# EAGLE design OSIVE Slim (EAGLE 9.0.1)

## Sheet 1 of 2
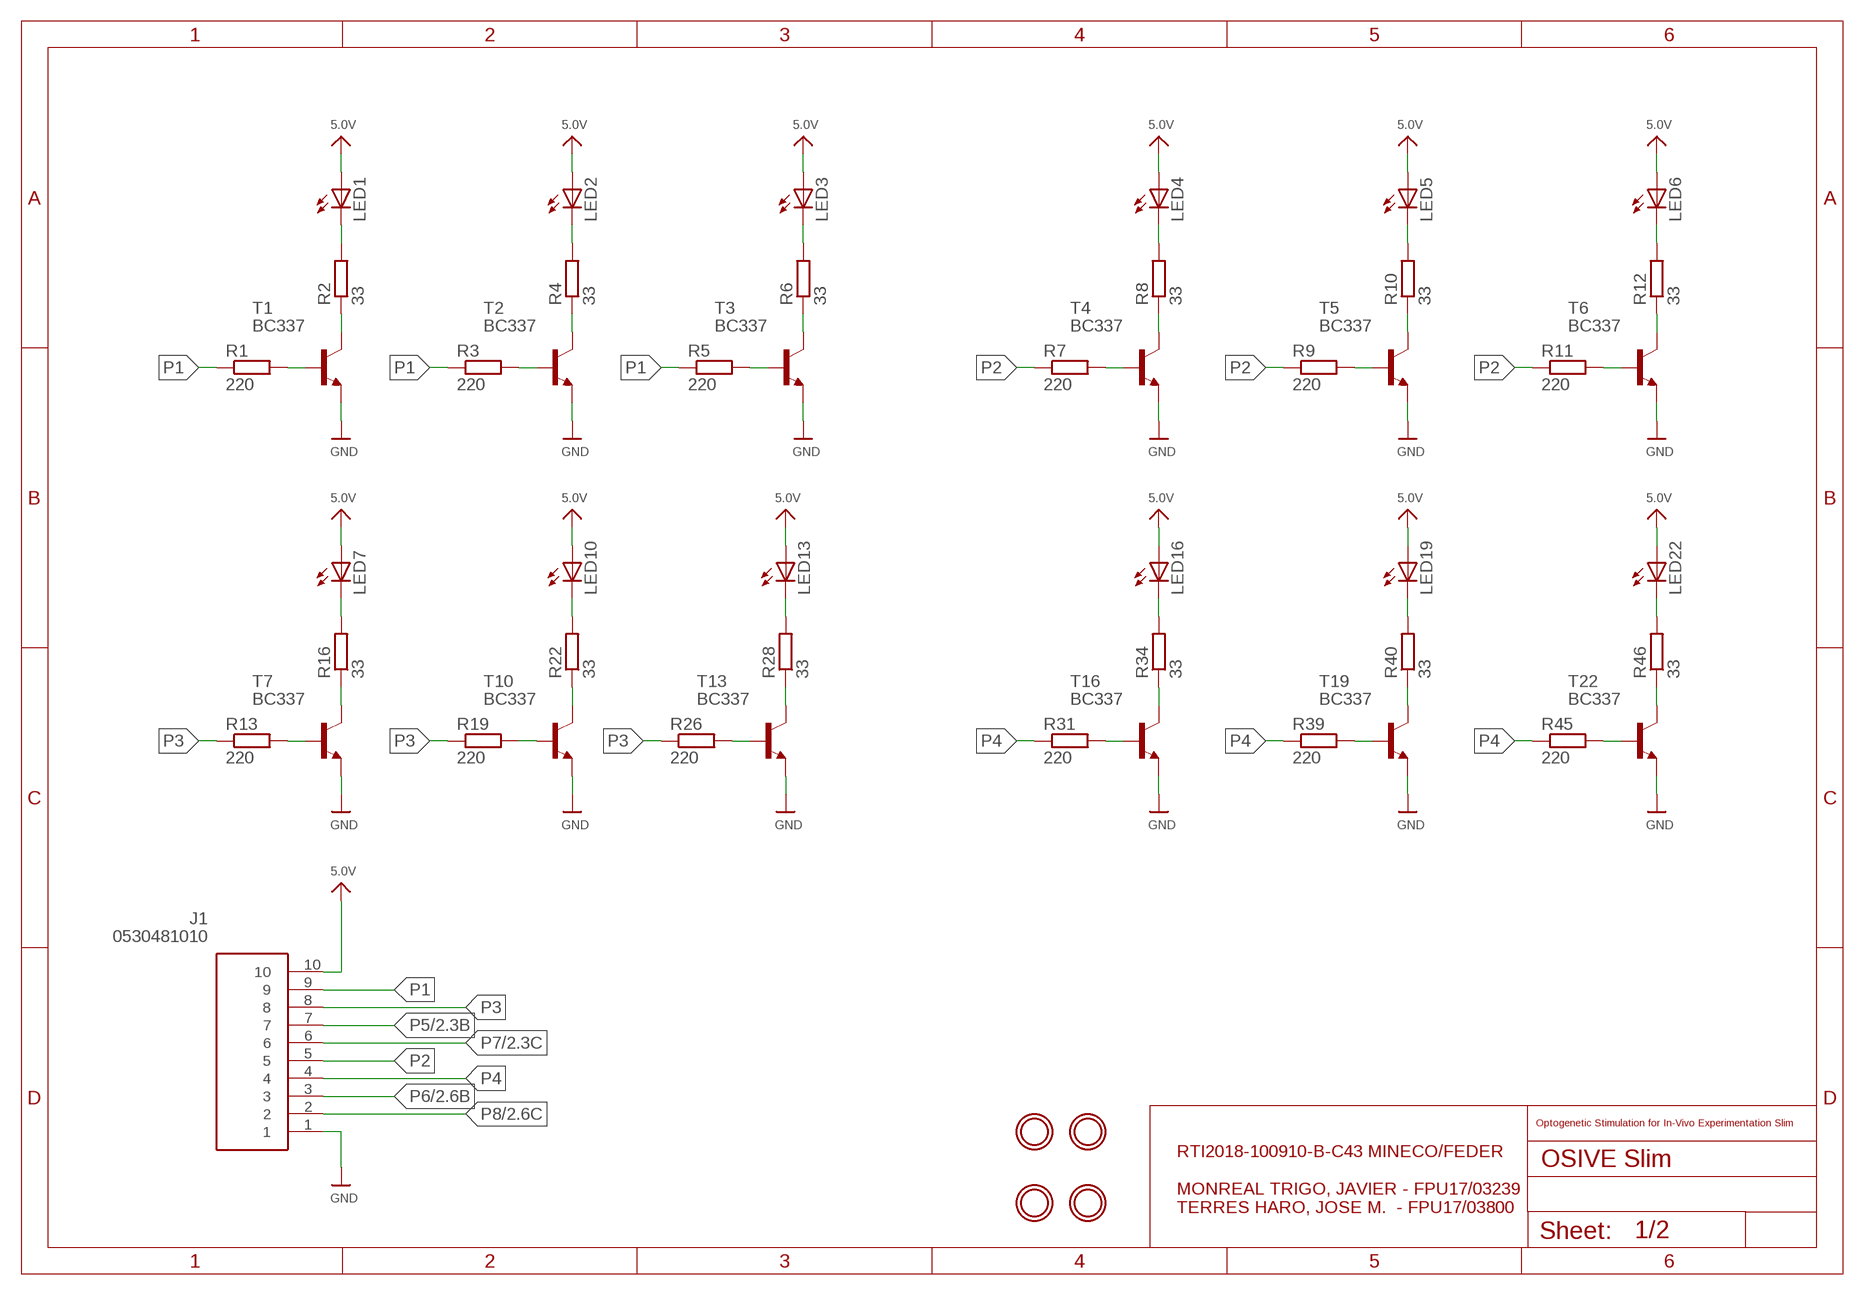
[diagram p0: schematic, sheet 1]

### Parts
H1  MOUNTINGHOLE3.0THIN  [MOUNTINGHOLE_3.0_PLATEDTHIN]
H2  MOUNTINGHOLE3.0THIN  [MOUNTINGHOLE_3.0_PLATEDTHIN]
H3  MOUNTINGHOLE3.0THIN  [MOUNTINGHOLE_3.0_PLATEDTHIN]
H4  MOUNTINGHOLE3.0THIN  [MOUNTINGHOLE_3.0_PLATEDTHIN]
J1  0530481010  [0530481010]
LED1  LED5MM  [LED5MM]
LED2  LED5MM  [LED5MM]
LED3  LED5MM  [LED5MM]
LED4  LED5MM  [LED5MM]
LED5  LED5MM  [LED5MM]
LED6  LED5MM  [LED5MM]
LED7  LED5MM  [LED5MM]
LED10  LED5MM  [LED5MM]
LED13  LED5MM  [LED5MM]
LED16  LED5MM  [LED5MM]
LED19  LED5MM  [LED5MM]
LED22  LED5MM  [LED5MM]
R1  220  R-EU_0204/7  [0204/7]
R2  33  R-EU_0204/7  [0204/7]
R3  220  R-EU_0204/7  [0204/7]
R4  33  R-EU_0204/7  [0204/7]
R5  220  R-EU_0204/7  [0204/7]
R6  33  R-EU_0204/7  [0204/7]
R7  220  R-EU_0204/7  [0204/7]
R8  33  R-EU_0204/7  [0204/7]
R9  220  R-EU_0204/7  [0204/7]
R10  33  R-EU_0204/7  [0204/7]
R11  220  R-EU_0204/7  [0204/7]
R12  33  R-EU_0204/7  [0204/7]
R13  220  R-EU_0204/7  [0204/7]
R16  33  R-EU_0204/7  [0204/7]
R19  220  R-EU_0204/7  [0204/7]
R22  33  R-EU_0204/7  [0204/7]
R26  220  R-EU_0204/7  [0204/7]
R28  33  R-EU_0204/7  [0204/7]
R31  220  R-EU_0204/7  [0204/7]
R34  33  R-EU_0204/7  [0204/7]
R39  220  R-EU_0204/7  [0204/7]
R40  33  R-EU_0204/7  [0204/7]
R45  220  R-EU_0204/7  [0204/7]
R46  33  R-EU_0204/7  [0204/7]
T1  BC337  [TO92]
T2  BC337  [TO92]
T3  BC337  [TO92]
T4  BC337  [TO92]
T5  BC337  [TO92]
T6  BC337  [TO92]
T7  BC337  [TO92]
T10  BC337  [TO92]
T13  BC337  [TO92]
T16  BC337  [TO92]
T19  BC337  [TO92]
T22  BC337  [TO92]

### Nets
5.0V: J1.10 LED1.A LED2.A LED3.A LED4.A LED5.A LED6.A LED7.A LED10.A LED13.A LED16.A LED19.A LED22.A ; also sheet 2
GND: J1.1 T1.1(E) T2.1(E) T3.1(E) T4.1(E) T5.1(E) T6.1(E) T7.1(E) T10.1(E) T13.1(E) T16.1(E) T19.1(E) T22.1(E) ; also sheet 2
N$1: R1.2 T1.2(B)
N$2: R3.2 T2.2(B)
N$3: R4.1 T2.3(C)
N$4: R5.2 T3.2(B)
N$5: R2.1 T1.3(C)
N$6: R6.1 T3.3(C)
N$7: R8.1 T4.3(C)
N$8: R10.1 T5.3(C)
N$9: R7.2 T4.2(B)
N$10: LED1.K(C) R2.2
N$11: R9.2 T5.2(B)
N$12: R12.1 T6.3(C)
N$13: R46.1 T22.3(C)
N$14: R40.1 T19.3(C)
N$15: R34.1 T16.3(C)
N$16: R28.1 T13.3(C)
N$17: R11.2 T6.2(B)
N$18: LED2.K(C) R4.2
N$19: R13.2 T7.2(B)
N$20: R22.1 T10.3(C)
N$21: R16.1 T7.3(C)
N$25: R19.2 T10.2(B)
N$26: LED3.K(C) R6.2
N$36: R26.2 T13.2(B)
N$37: R31.2 T16.2(B)
N$38: R39.2 T19.2(B)
N$39: R45.2 T22.2(B)
N$42: LED4.K(C) R8.2
N$46: LED5.K(C) R10.2
N$50: LED6.K(C) R12.2
N$66: LED7.K(C) R16.2
N$70: LED10.K(C) R22.2
N$74: LED13.K(C) R28.2
N$90: LED16.K(C) R34.2
N$94: LED19.K(C) R40.2
N$98: LED22.K(C) R46.2
P1: J1.9 R1.1 R3.1 R5.1
P2: J1.5 R7.1 R9.1 R11.1
P3: J1.8 R13.1 R19.1 R26.1
P4: J1.4 R31.1 R39.1 R45.1
P5: J1.7 ; also sheet 2
P6: J1.3 ; also sheet 2
P7: J1.6 ; also sheet 2
P8: J1.2 ; also sheet 2

### Notes on the sheet
- Optogenetic Stimulation for In-Vivo Experimentation Slim
- RTI2018-100910-B-C43 MINECO/FEDER
  
  MONREAL TRIGO, JAVIER - FPU17/03239
  TERRES HARO, JOSE M.  - FPU17/03800

## Sheet 2 of 2
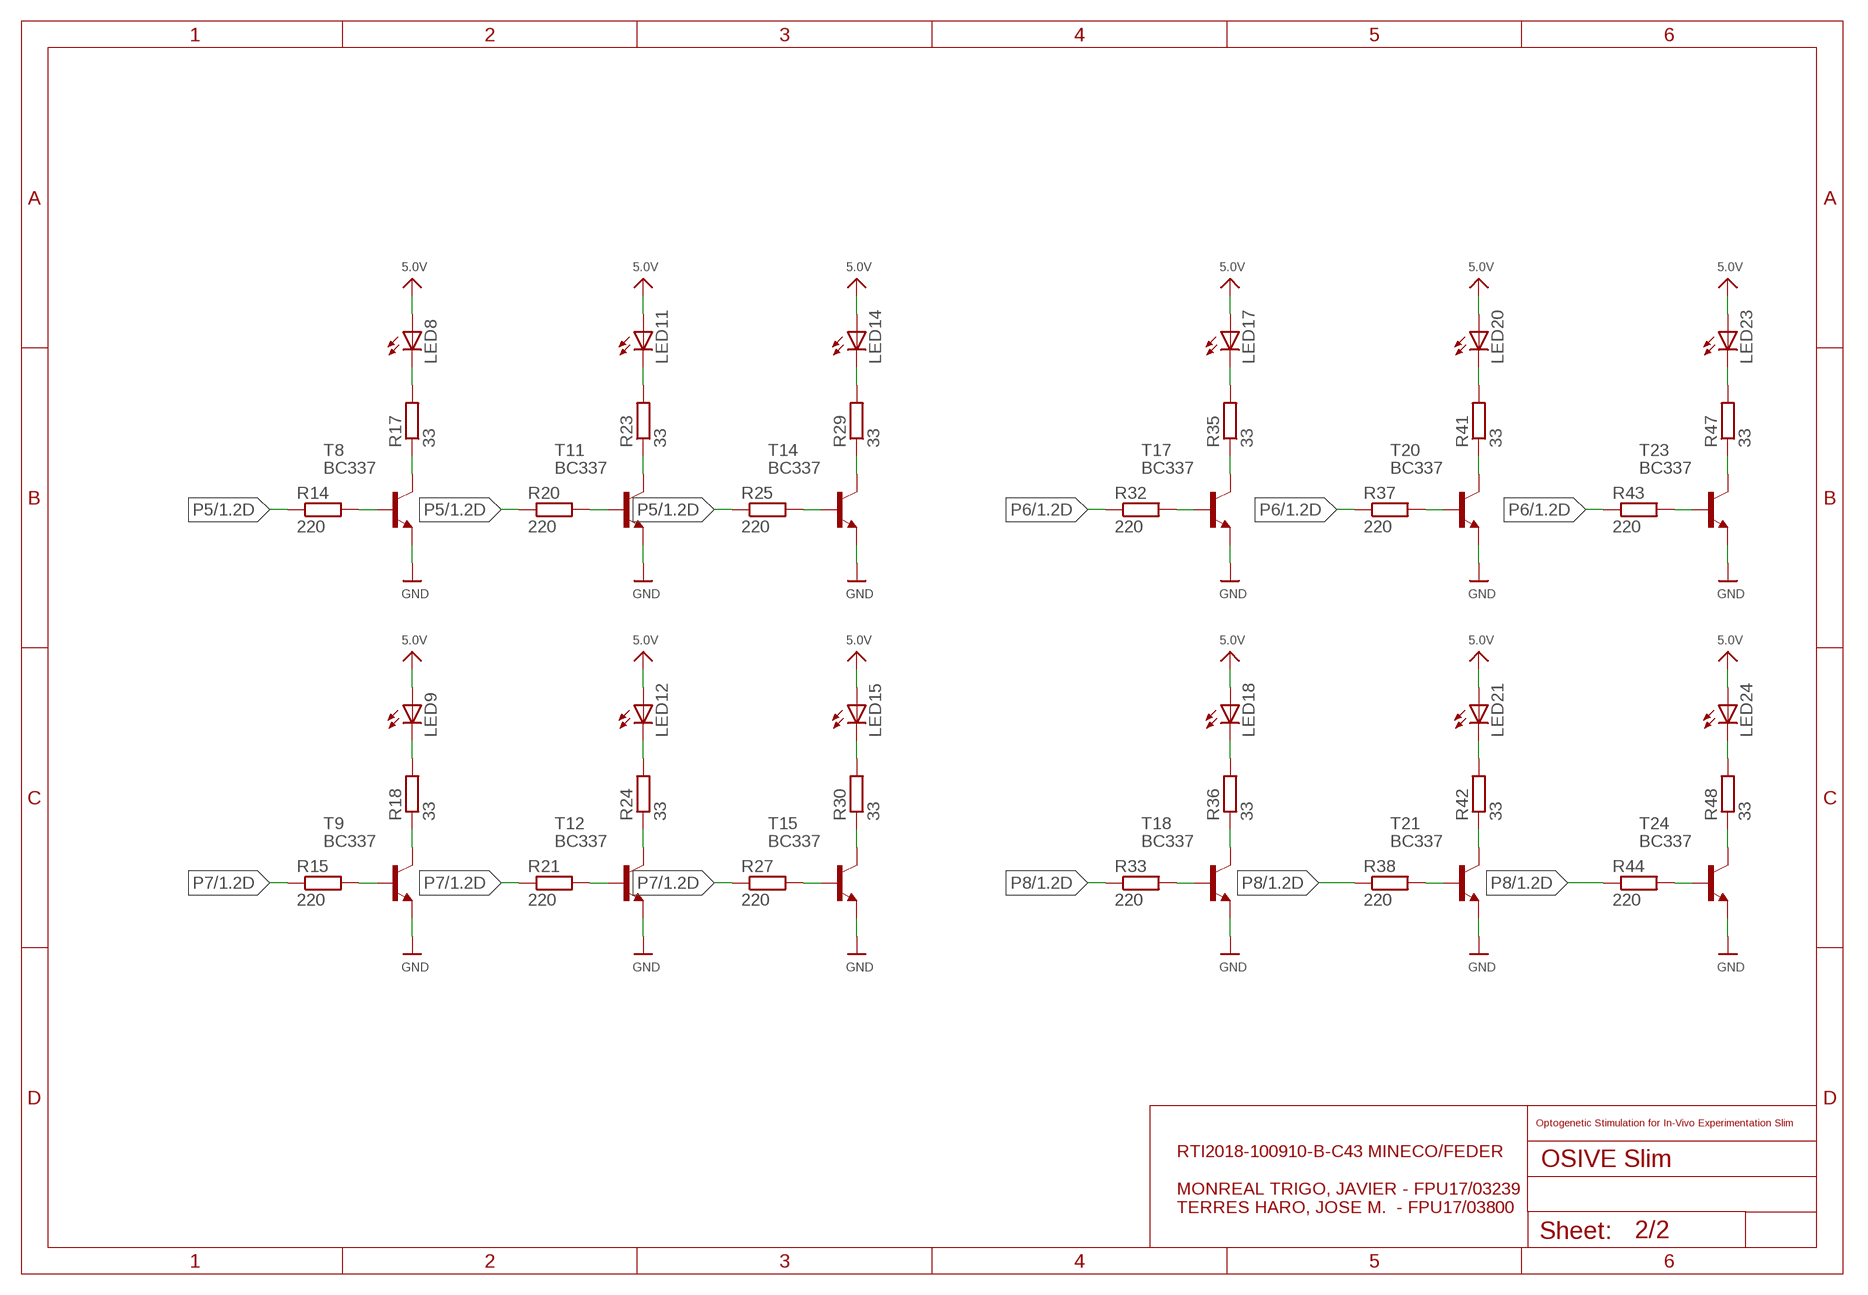
[diagram p1: schematic, sheet 2]

### Parts
LED8  LED5MM  [LED5MM]
LED9  LED5MM  [LED5MM]
LED11  LED5MM  [LED5MM]
LED12  LED5MM  [LED5MM]
LED14  LED5MM  [LED5MM]
LED15  LED5MM  [LED5MM]
LED17  LED5MM  [LED5MM]
LED18  LED5MM  [LED5MM]
LED20  LED5MM  [LED5MM]
LED21  LED5MM  [LED5MM]
LED23  LED5MM  [LED5MM]
LED24  LED5MM  [LED5MM]
R14  220  R-EU_0204/7  [0204/7]
R15  220  R-EU_0204/7  [0204/7]
R17  33  R-EU_0204/7  [0204/7]
R18  33  R-EU_0204/7  [0204/7]
R20  220  R-EU_0204/7  [0204/7]
R21  220  R-EU_0204/7  [0204/7]
R23  33  R-EU_0204/7  [0204/7]
R24  33  R-EU_0204/7  [0204/7]
R25  220  R-EU_0204/7  [0204/7]
R27  220  R-EU_0204/7  [0204/7]
R29  33  R-EU_0204/7  [0204/7]
R30  33  R-EU_0204/7  [0204/7]
R32  220  R-EU_0204/7  [0204/7]
R33  220  R-EU_0204/7  [0204/7]
R35  33  R-EU_0204/7  [0204/7]
R36  33  R-EU_0204/7  [0204/7]
R37  220  R-EU_0204/7  [0204/7]
R38  220  R-EU_0204/7  [0204/7]
R41  33  R-EU_0204/7  [0204/7]
R42  33  R-EU_0204/7  [0204/7]
R43  220  R-EU_0204/7  [0204/7]
R44  220  R-EU_0204/7  [0204/7]
R47  33  R-EU_0204/7  [0204/7]
R48  33  R-EU_0204/7  [0204/7]
T8  BC337  [TO92]
T9  BC337  [TO92]
T11  BC337  [TO92]
T12  BC337  [TO92]
T14  BC337  [TO92]
T15  BC337  [TO92]
T17  BC337  [TO92]
T18  BC337  [TO92]
T20  BC337  [TO92]
T21  BC337  [TO92]
T23  BC337  [TO92]
T24  BC337  [TO92]

### Nets
5.0V: LED8.A LED9.A LED11.A LED12.A LED14.A LED15.A LED17.A LED18.A LED20.A LED21.A LED23.A LED24.A ; also sheet 1
GND: T8.1(E) T9.1(E) T11.1(E) T12.1(E) T14.1(E) T15.1(E) T17.1(E) T18.1(E) T20.1(E) T21.1(E) T23.1(E) T24.1(E) ; also sheet 1
N$22: R35.1 T17.3(C)
N$23: R29.1 T14.3(C)
N$24: R17.1 T8.3(C)
N$27: R47.1 T23.3(C)
N$28: R41.1 T20.3(C)
N$29: R18.1 T9.3(C)
N$30: R24.1 T12.3(C)
N$31: R30.1 T15.3(C)
N$32: R48.1 T24.3(C)
N$33: R42.1 T21.3(C)
N$34: R36.1 T18.3(C)
N$35: R23.1 T11.3(C)
N$40: R43.2 T23.2(B)
N$41: R37.2 T20.2(B)
N$43: R32.2 T17.2(B)
N$44: R25.2 T14.2(B)
N$45: R20.2 T11.2(B)
N$47: R14.2 T8.2(B)
N$48: R15.2 T9.2(B)
N$49: R21.2 T12.2(B)
N$51: R27.2 T15.2(B)
N$52: R33.2 T18.2(B)
N$53: R38.2 T21.2(B)
N$54: R44.2 T24.2(B)
N$114: LED8.K(C) R17.2
N$118: LED11.K(C) R23.2
N$122: LED14.K(C) R29.2
N$138: LED17.K(C) R35.2
N$142: LED20.K(C) R41.2
N$146: LED23.K(C) R47.2
N$162: LED9.K(C) R18.2
N$166: LED12.K(C) R24.2
N$170: LED15.K(C) R30.2
N$186: LED18.K(C) R36.2
N$190: LED21.K(C) R42.2
N$194: LED24.K(C) R48.2
P5: R14.1 R20.1 R25.1 ; also sheet 1
P6: R32.1 R37.1 R43.1 ; also sheet 1
P7: R15.1 R21.1 R27.1 ; also sheet 1
P8: R33.1 R38.1 R44.1 ; also sheet 1

### Notes on the sheet
- Optogenetic Stimulation for In-Vivo Experimentation Slim
- RTI2018-100910-B-C43 MINECO/FEDER
  
  MONREAL TRIGO, JAVIER - FPU17/03239
  TERRES HARO, JOSE M.  - FPU17/03800

## Library data of the parts
H1-H4 = microbuilder:MOUNTINGHOLE: Mounting Hole For #2 screws (0.086"/2.18mm width, 0.094"/2.4mm hole) use 2.5mm
J1 = 0530481010:0530481010: Conn Shrouded Header (4 Sides) HDR 10 POS 1.25mm Solder RA Thru-Hole PicoBlade Tray Source: Datasheet <https://datasheet.datasheetarchive.com/originals/distributors/Datasheets-DGA22/2091711.pdf>; ARROW_PART_NUMBER: 0530481010; ARROW_PRICE-STOCK: https://www.arrow.com/en/products/0530481010/molex; DESCRIPTION: Conn Shrouded Header (4 Sides) HDR 10 POS 1.25mm Solder RA Thru-Hole PicoBlade Tray; HEIGHT: 3.7mm; MANUFACTURER_NAME: Molex; MANUFACTURER_PART_NUMBER: 0530481010
LED1-LED24 = led:LED: LED OSRAM: - CHIPLED LG R971, LG N971, LY N971, LG Q971, LY Q971, LO R971, LY R971 LH N974, LH R974 LS Q976, LO Q976, LY Q976 LO Q996 - Hyper CHIPLED LW Q18S LB Q993, LB Q99A, LB R99A - SideLED LS A670, LO A670, LY A670, LG A670, LP A670 LB A673, LV A673, LT A673, LW A673 LH A674 LY A675 LS A676, LA A676, LO A676, LY A676, LW A676 LS A679, LY A679, LG A679 - Hyper Micro SIDELED® LS Y876, LA Y876, LO Y876, LY Y876 LT Y87S - SmartLED LW L88C, LW L88S LB L89C, LB L89S, LG L890 LS L89K, LO L89K, LY L89K LS L896, LA L896, LO L896, LY L896 - TOPLED LS T670, LO T670, LY T670, LG T670, LP T670 LSG T670, LSP T670, LSY T670, LOP T670, LYG T670 LG T671, LOG T671, LSG T671 LB T673, LV T673, LT T673, LW T673 LH T674 LS T676, LA T676, LO T676, LY T676, LB T676, LH T676, LSB T676, LW T676 LB T67C, LV T67C, LT T67C, LS T67K, LO T67K, LY T67K, LW E67C LS E67B, LA E67B, LO E67B, LY E67B, LB E67C, LV E67C, LT E67C LW T67C LS T679, LY T679, LG T679 LS T770, LO T770, LY T770, LG T770, LP T770 LB T773, LV T773, LT T773, LW T773 LH T774 LS E675, LA E675, LY E675, LS T675 LS T776, LA T776, LO T776, LY T776, LB T776 LHGB T686 LT T68C, LB T68C - Hyper Mini TOPLED® LB M676 - Mini TOPLED Santana® LG M470 LS M47K, LO M47K, LY M47K Source: http://www.osram.convergy.de LUXEON: - LUMILED® LXK2-PW12-R00, LXK2-PW12-S00, LXK2-PW14-U00, LXK2-PW14-V00 LXK2-PM12-R00, LXK2-PM12-S00, LXK2-PM14-U00 LXK2-PE12-Q00, LXK2-PE12-R00, LXK2-PE12-S00, LXK2-PE14-T00, LXK2-PE14-U00 LXK2-PB12-K00, LXK2-PB12-L00, LXK2-PB12-M00, LXK2-PB14-N00, LXK2-PB14-P00, LXK2-PB14-Q00 LXK2-PR12-L00, LXK2-PR12-M00, LXK2-PR14-Q00, LXK2-PR14-R00 LXK2-PD12-Q00, LXK2-PD12-R00, LXK2-PD12-S00 LXK2-PH12-R00, LXK2-PH12-S00 LXK2-PL12-P00, LXK2-PL12-Q00, LXK2-PL12-R00 Source: www.luxeon.com KINGBRIGHT: KA-3528ASYC Source: www.kingbright.com
R1-R48 = resistor:R-EU_: RESISTOR, European symbol
T1-T24 = transistor:BC337: NPN TRANSISTOR

## Board
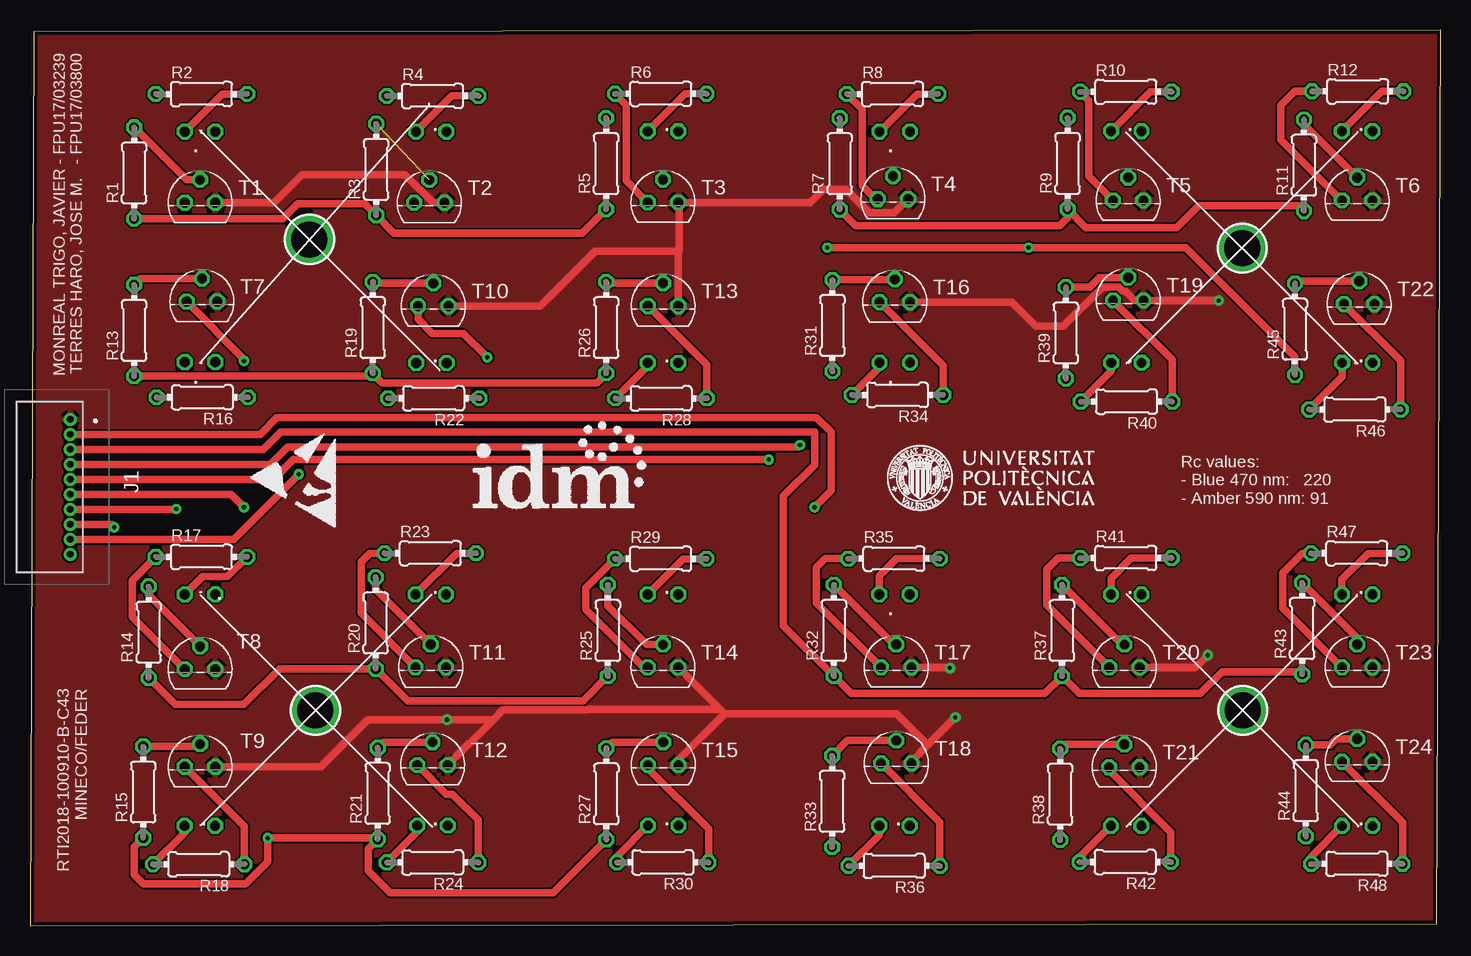
[diagram p2: board, top side]
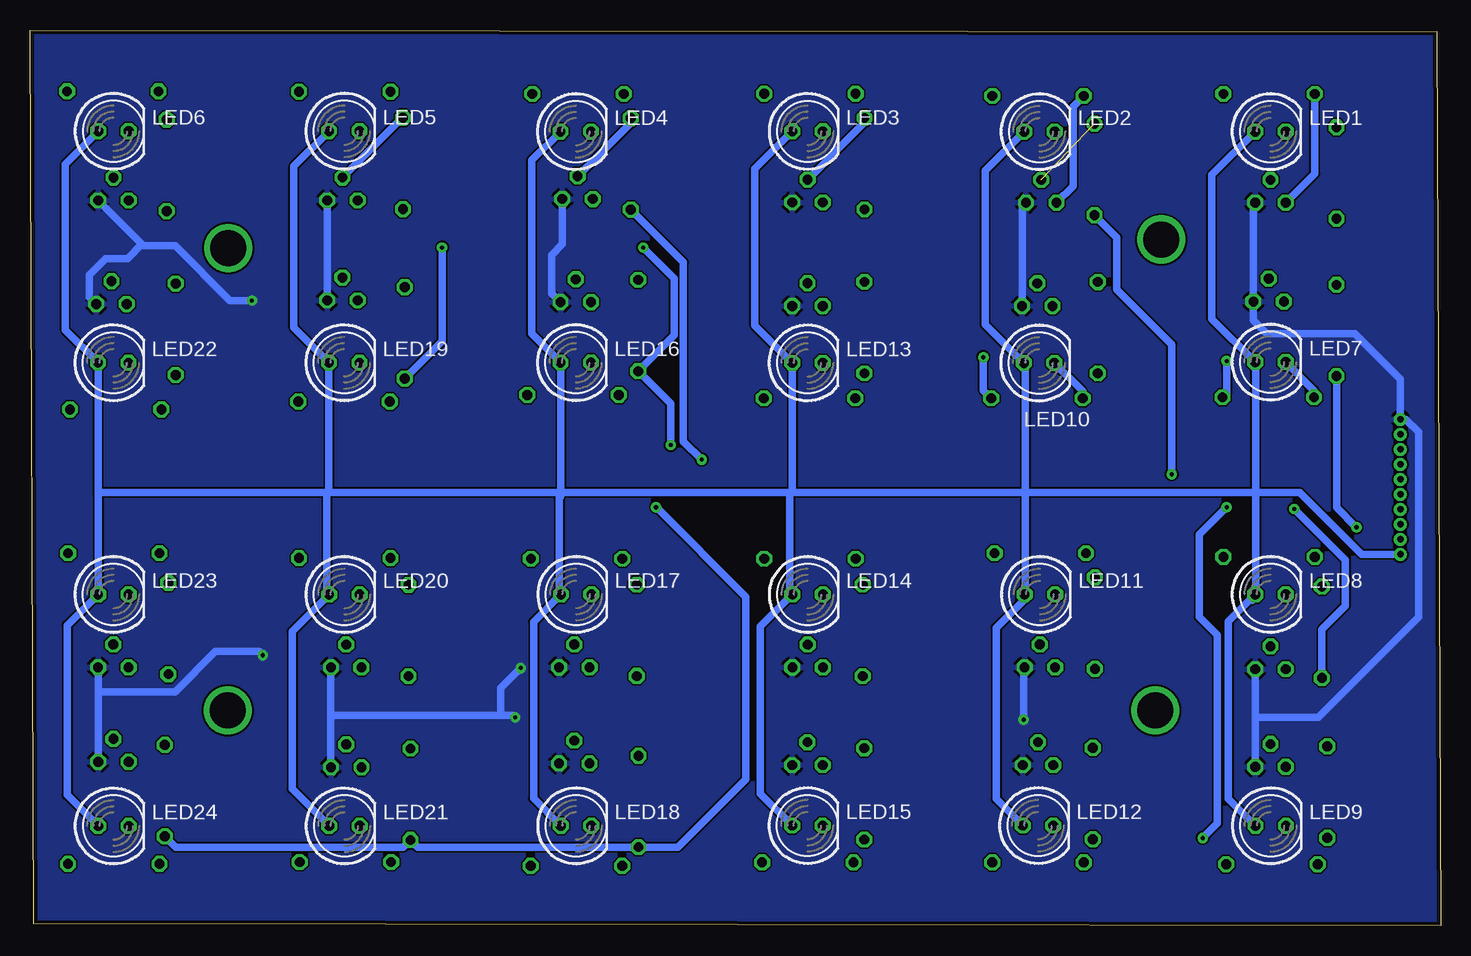
[diagram p3: board, bottom side, seen from below]

Size 117.55 x 74.69 mm. Coordinates in mm from the lower left corner, seen from the top.
Outline: 0,0 117.24,0.15 117.55,74.69 0.3,74.53 0,0
Copper layers (1*16): Top 0.035mm / dielectric 1.5mm / Bottom 0.035mm
Design rules "default *": minimum track width 6mil, minimum drill 0.3mm, track to track 6mil, track to pad 6mil, pad to pad 6mil, via to via 6mil, smd to smd 6mil, copper to edge 12mil, drill to drill 12mil, minimum pad ring 10mil, minimum via ring 10mil, stop-mask expansion 4mil, vias tented up to drill 0mil, thermal gap 10mil

### Footprints (pad centres in the part's own frame; a part is rotated, then mirrored left to right if it is on the bottom)
MOUNTINGHOLE_3.0_PLATEDTHIN = drill 3 pad 3.6: P$1 0,0
0530481010 = drill 0.55 pad 1.1: 1 0,0; 2 -1.25,0; 3 -2.5,0; 4 -3.75,0; 5 -5,0; 6 -6.25,0; 7 -7.5,0; 8 -8.75,0; 9 -10,0; 10 -11.25,0
LED5MM = drill 0.813 octagon: A -1.27,0; K 1.27,0
0204/7 = drill 0.813 octagon: 1 -3.81,0; 2 3.81,0
TO92 = drill 0.813 octagon: 1 1.27,0; 2 0,1.905; 3 -1.27,0

### Placement (x,y rotation side)
H1  23.79,17.97 0 top
H2  101.06,17.95 0 top
H3  23.28,57.22 0 top
H4  101.02,56.51 0 top
J1  3.35,42.21 90 top
LED1  14.18,66.21 0 bottom
LED2  33.43,66.21 0 bottom
LED3  52.75,66.23 0 bottom
LED4  72.07,66.22 0 bottom
LED5  91.36,66.25 0 bottom
LED6  110.6,66.25 0 bottom
LED7  14.18,47 0 bottom
LED8  14.18,27.62 0 bottom
LED9  14.15,8.34 0 bottom
LED10  33.46,46.92 0 bottom
LED11  33.39,27.62 0 bottom
LED12  33.55,8.35 0 bottom
LED13  52.76,46.93 0 bottom
LED14  52.74,27.62 0 bottom
LED15  52.77,8.35 0 bottom
LED16  72.07,46.95 0 bottom
LED17  72.03,27.63 0 bottom
LED18  72.04,8.34 0 bottom
LED19  91.36,46.94 0 bottom
LED20  91.35,27.62 0 bottom
LED21  91.35,8.32 0 bottom
LED22  110.61,46.94 0 bottom
LED23  110.6,27.62 0 bottom
LED24  110.6,8.32 0 bottom
R1  8.67,62.76 90 top
R2  14.29,69.35 0 top
R3  28.84,63.06 90 top
R4  33.55,69.19 0 top
R5  48.01,63.54 90 top
R6  52.56,69.37 0 top
R7  67.48,63.52 90 top
R8  71.88,69.35 0 top
R9  86.47,63.56 90 top
R10  91.32,69.54 0 top
R11  106.16,63.4 90 top
R12  110.65,69.57 0 top
R13  8.67,49.63 90 top
R14  9.89,24.47 90 top
R15  9.44,11.14 90 top
R16  14.36,44.06 180 top
R17  14.29,30.75 0 top
R18  14.06,5.13 180 top
R19  28.56,49.87 90 top
R20  28.81,25.23 90 top
R21  28.98,11.02 90 top
R22  33.64,43.98 180 top
R23  33.36,31.06 0 top
R24  33.55,5.28 180 top
R25  48.16,24.62 90 top
R26  48.02,49.87 90 top
R27  48.03,10.99 90 top
R28  52.59,43.97 180 top
R29  52.55,30.6 0 top
R30  52.73,5.28 180 top
R31  66.87,50.05 90 top
R32  66.99,24.63 90 top
R33  66.84,10.36 90 top
R34  72.29,44.25 180 top
R35  72,30.61 0 top
R36  72.02,4.99 180 top
R37  86,24.62 90 top
R38  85.84,10.96 90 top
R39  86.32,49.43 90 top
R40  91.37,43.7 180 top
R41  91.32,30.66 0 top
R42  91.27,5.31 180 top
R43  106.02,24.78 90 top
R44  106.32,11.26 90 top
R45  105.41,49.73 90 top
R46  110.41,43.04 180 top
R47  110.57,31.06 0 top
R48  110.57,5.16 180 top
T1  14.18,60.29 0 top
T2  33.28,60.28 0 top
T3  52.75,60.31 0 top
T4  71.91,60.59 0 top
T5  91.51,60.48 0 top
T6  110.6,60.47 0 top
T7  14.33,52.04 0 top
T8  14.18,21.39 0 top
T9  14.18,13.25 0 top
T10  33.61,51.66 0 top
T11  33.39,21.54 0 top
T12  33.55,13.4 0 top
T13  52.76,51.67 0 top
T14  52.74,21.54 0 top
T15  52.77,13.4 0 top
T16  72.07,52 0 top
T17  72.19,21.55 0 top
T18  72.19,13.53 0 top
T19  91.52,52.14 0 top
T20  91.2,21.54 0 top
T21  91.19,13.21 0 top
T22  110.76,51.84 0 top
T23  110.6,21.54 0 top
T24  110.6,13.67 0 top

### Tracks (layer width: path | path; a pad name or v marks a point on that pad's centre or on a via)
5.0V
  Bottom 0.61: J1.10 6.58,30.97 11.73,36.12 15.39,36.12 | 15.39,36.12 34.59,36.12 | 34.59,36.12 54.25,36.12 | 54.25,36.12 73.46,36.12 | 73.46,36.12 92.81,36.12 | 92.81,36.12 111.71,36.12 111.87,35.96 | 111.87,35.96 LED23.A 114.45,25.05 114.45,10.9 LED24.A | 111.87,35.96 LED22.A 114.61,49.67 114.61,63.51 LED6.A | 92.81,36.12 92.81,27.81 LED20.A 95.71,24.53 95.71,11.41 LED21.A | 73.46,36.12 73.46,35.66 | 73.46,35.66 73.46,27.78 LED17.A 75.59,25.34 75.59,10.62 LED18.A | 54.25,36.12 54.25,27.86 LED14.A 56.69,24.94 56.69,11.01 LED15.A | 34.59,36.12 34.59,27.69 LED11.A 34.66,27.21 37.03,24.84 37.03,10.57 LED12.A | 15.39,36.12 15.39,27.43 15.7,27.13 15.7,27.37 LED8.A 17.68,25.39 17.68,10.59 LED9.A | 15.39,36.12 15.39,46.94 LED7.A 19.05,50.6 19.05,62.61 LED1.A | 34.59,36.12 34.59,46.79 LED10.A 37.95,50.14 37.95,62.96 LED2.A | 54.25,36.12 54.03,36.35 LED13.A 57.15,50.05 57.15,63.1 LED3.A | 73.46,35.66 73.34,35.78 LED16.A 75.74,49.36 75.74,63.81 LED4.A | 92.81,36.12 92.63,36.3 LED19.A 95.56,49.86 95.56,63.33 LED5.A
GND  (via drill 0.35)
  Top 0.61: v98.15,22.56 97.13,21.54 T20.1 | v77.11,17.37 74.83,15.09 | 74.83,15.09 73.46,13.72 T18.1 | v76.66,21.49 76.6,21.55 T17.1 | 74.83,15.09 72.24,17.68 57.88,17.68 | 57.88,17.68 57.51,18.04 | 57.51,18.04 T14.1 | 57.88,17.68 54.04,13.84 T15.1 | 57.51,18.04 46.47,18.04 46.41,17.98 39.4,17.98 38.6,17.18 | 38.6,17.18 T12.1 | T9.1 24.22,13.25 28.15,17.18 v34.75,17.18 38.6,17.18 | T1.1 20.36,60.29 22.71,62.64 31.23,62.64 33.59,60.28 T2.1 | T10.1 42.52,51.66 47.09,56.24 54.03,56.24 | 54.03,56.24 54.1,56.24 54.1,56.54 | 54.1,56.54 54.1,60.22 T3.1 65.03,60.31 66.14,61.42 67.97,61.42 69.95,59.44 72.03,59.44 T4.1 | T13.1 54.03,56.24 | 54.03,56.24 54.03,56.47 54.1,56.54 | T16.1 81.81,52 83.82,49.99 86.12,49.99 89.39,53.26 90.72,53.26 91.05,52.93 91.29,52.93 92.08,52.14 T19.1 99.04,52.14 v99.06,52.12
  Bottom 0.61: T24.1 111.87,19.51 | 111.87,19.51 T23.1 | 111.87,19.51 105.46,19.51 102.11,22.86 98.45,22.86 v98.15,22.56 | T20.1 92.47,17.53 | 92.47,17.53 92.47,13.22 T21.1 | 92.47,17.53 78.33,17.53 | 78.33,17.53 77.27,17.53 v77.11,17.37 | 78.33,17.53 78.33,19.81 v76.66,21.49 | T11.1 34.75,21.46 v34.75,17.18 | T9.1 15.45,17.53 | 15.45,17.53 T8.1 | 15.45,17.53 15.29,17.37 10.21,17.37 1.83,25.76 1.83,41.15 2.9,42.22 J1.1 3.35,45.57 7.16,49.38 14.48,49.38 15.6,50.5 T7.1 15.6,60.14 T1.1 | T2.1 34.88,59.95 T10.1 | T4.1 73.19,56.81 74.07,55.93 74.07,52.73 T16.1 | T19.1 T5.1 | v99.06,52.12 100.89,52.12 105.46,56.69 108.09,56.69 108.22,56.83 | T6.1 108.22,56.83 | 108.22,56.83 109.42,55.63 111.25,55.63 112.62,54.25 112.62,52.43 T22.1
  pour Bottom: 0.46,74.68 117.65,74.83 117.35,0 0.15,-0.15
  pour Top: 0.61,74.52 117.65,74.68 117.35,0 0.3,-0.15
N$1
  Top 0.61: R1.2 13.05,62.19 T1.2
N$2  (1 unrouted)
N$3
  Bottom 0.61: T2.3 30.63,61.66 30.63,68.29 R4.1
N$4
  Bottom 0.61: T3.2 48.01,66.95 R5.2
N$5
  Bottom 0.61: T1.3 10.48,62.71 R2.1
N$6
  Top 0.61: R6.1 49.68,68.43 49.68,62.1 T3.3
N$7
  Top 0.61: R8.1 69.34,68.07 69.34,61.72 70.47,60.59 T4.3
N$8
  Top 0.61: R10.1 88.24,68.81 88.24,62.48 T5.3
N$9
  Bottom 0.61: T4.2 67.48,66.93 R7.2
N$10
  Top 0.61: LED1.K 16.04,69.35 R2.2
N$11
  Bottom 0.61: T5.2 86.53,67.37 R9.2
N$12
  Top 0.61: R12.1 105.38,69.57 104.24,68.43 104.24,65.56 T6.3
N$13
  Top 0.61: T22.3 114.22,47.11 R46.1
N$14
  Top 0.61: T19.3 95.19,47.2 R40.1
N$15
  Top 0.61: T16.3 76.1,46.69 R34.1
N$16
  Top 0.61: R28.1 56.4,46.78 51.51,51.67 T13.3
N$17
  Top 0.61: R11.2 106.16,66.81 T6.2
N$18
  Top 0.61: R4.2 35.14,69.19 LED2.K
N$19
  Top 0.61: T7.2 9.18,53.95 R13.2
N$20  (via drill 0.35)
  Top 0.61: v38.1,47.4 36.12,49.38 33.53,49.38 32.34,50.57 T10.3
  Bottom 0.61: R22.1 38.1,44.63 v38.1,47.4
N$21  (via drill 0.35)
  Top 0.61: T7.3 17.83,47.27 v17.83,47.09
  Bottom 0.61: v17.83,47.09 17.83,46.33 17.83,44.4 R16.1
N$22
  Top 0.61: R35.1 66.27,30.61 65.53,29.87 65.53,26.93 T17.3
N$23
  Top 0.61: R29.1 47.69,29.55 | 47.69,29.55 | 47.69,29.55 46.33,28.18 46.33,26.37 51.15,21.54 T14.3
N$24
  Top 0.61: R17.1 8.53,28.81 8.53,25.76 T8.3
N$25
  Top 0.61: T10.2 28.67,53.57 R19.2
N$26
  Top 0.61: LED3.K 54.61,69.37 R6.2
N$27
  Top 0.61: R47.1 106.04,31.06 104.39,29.41 104.39,26.48 T23.3
N$28
  Top 0.61: R41.1 85.68,30.66 84.73,29.72 84.73,26.74 T20.3
N$29
  Top 0.61: T9.3 17.87,8.29 R18.1
N$30
  Top 0.61: R24.1 37.36,8.82 35.2,10.97 34.7,10.97 T12.3
N$31
  Top 0.61: R30.1 56.54,8.08 51.5,13.12 T15.3
N$32
  Top 0.61: T24.3 114.38,8.62 R48.1
N$33
  Top 0.61: R42.1 95.08,7.79 89.92,12.95 T21.3
N$34
  Top 0.61: T18.3 75.83,8.63 R36.1
N$35
  Top 0.61: R23.1 28.32,31.06 27.58,30.33 27.58,26.08 T11.3
N$36
  Top 0.61: T13.2 48.12,53.57 R26.2
N$37
  Top 0.61: R31.2 72.02,53.86 T16.2
N$38
  Top 0.61: R39.2 88.29,53.24 89.1,54.05 T19.2
N$39
  Top 0.61: T22.2 105.61,53.74 R45.2
N$40
  Top 0.61: R43.2 110.6,24 T23.2
N$41
  Top 0.61: R37.2 90.99,23.44 T20.2
N$42
  Top 0.61: LED4.K 73.93,69.35 R8.2
N$43
  Top 0.61: R32.2 71.97,23.45 T17.2
N$44
  Top 0.61: R25.2 48.16,26.67 51.38,23.45 T14.2
N$45
  Top 0.61: R20.2 28.81,28.04 T11.2
N$46
  Top 0.61: LED5.K 93.37,69.54 R10.2
N$47
  Top 0.61: T8.2 9.89,27.58 R14.2
N$48
  Top 0.61: R15.2 13.98,14.95 T9.2
N$49
  Top 0.61: R21.2 29.45,15.3 T12.2
N$50
  Top 0.61: LED6.K 112.65,69.57 R12.2
N$51
  Top 0.61: T15.2 48.53,15.3 R27.2
N$52
  Top 0.61: R33.2 68.11,15.44 T18.2
N$53
  Top 0.61: R38.2 86.19,15.12 T21.2
N$54
  Top 0.61: R44.2 108.34,15.07 108.84,15.58 T24.2
N$66
  Bottom 0.61: R16.2 10.55,44.64 LED7.K
N$70
  Bottom 0.61: R22.2 29.83,44.56 LED10.K
N$74
  Top 0.61: R28.2 51.49,46.68 LED13.K
N$90
  Top 0.61: R34.2 70.8,46.57 LED16.K
N$94
  Top 0.61: LED19.K 90.09,46.23 R40.2
N$98
  Top 0.61: R46.2 109.34,45.79 LED22.K
N$114
  Top 0.61: LED8.K 14.39,29.11 16.45,29.11 R17.2
N$118
  Top 0.61: LED11.K 35.56,31.06 R23.2
N$122
  Top 0.61: LED14.K 54.45,30.6 R29.2
N$138
  Top 0.61: LED17.K 70.77,29.16 72.21,30.61 R35.2
N$142
  Top 0.61: LED20.K 90.08,28.97 91.77,30.66 R41.2
N$146
  Top 0.61: LED23.K 109.33,28.87 111.53,31.06 R47.2
N$162
  Top 0.61: LED9.K 12.88,7.77 R18.2
N$166
  Top 0.61: R24.2 32.28,7.82 LED12.K
N$170
  Top 0.61: LED15.K 48.92,5.78 R30.2
N$186
  Top 0.61: LED18.K 70.77,7.56 R36.2
N$190
  Top 0.61: LED21.K 87.46,5.7 R42.2
N$194
  Top 0.61: LED24.K 106.76,5.75 R48.2
P1  (via drill 0.35)
  Top 0.61: J1.9 16.98,32.22 v22.4,37.64 | R1.1 21.07,58.95 22.32,60.2 27.89,60.2 R3.1 30.33,57.76 46.04,57.76 R5.1
  Bottom 0.61: v22.4,37.64 22.4,48.46 26.98,53.04 26.98,57.38 R3.1
P2  (via drill 0.35)
  Top 0.61: J1.5 20.3,37.22 21.95,38.86 v61.57,38.86 | R7.1 68.82,58.37 85.8,58.37 86.47,59.04 R9.1 88,58.22 95.56,58.22 97.38,60.05 105.7,60.05 R11.1
  Bottom 0.61: v61.57,38.86 63.09,40.39 63.09,55.32 R7.1
P3  (via drill 0.35)
  Top 0.61: J1.8 6.77,33.47 v7.01,33.22 | R13.1 28.33,45.82 R19.1 29.36,45.26 47.22,45.26 R26.1
  Bottom 0.61: v7.01,33.22 8.67,34.89 R13.1
P4  (via drill 0.35)
  Top 0.61: J1.4 20.02,38.47 21.49,39.93 64.01,39.93 v64.16,40.08 | R45.1 105.41,47.45 96.32,56.54 v83.21,56.54 v66.45,56.54
  Bottom 0.61: v64.16,40.08 64.16,43.53 R31.1 63.86,49.25 63.86,53.95 v66.45,56.54 | R39.1 83.21,48.73 v83.21,56.54
P5  (via drill 0.35)
  Top 0.61: J1.7 12.16,34.72 v12.19,34.75 | R14.1 12.11,18.44 17.83,18.44 20.81,21.42 R20.1 31.48,18.75 46.09,18.75 R25.1
  Bottom 0.61: v12.19,34.75 7.92,30.48 7.92,26.67 9.89,24.7 R14.1
P6
  Top 0.61: J1.3 19.45,39.72 20.88,41.15 65.38,41.15 65.38,38.41 62.79,35.81 62.79,25.02 R32.1 68.45,19.36 84.55,19.36 R37.1 87.46,19.36 97.54,19.36 99.36,21.18 105.8,21.18 R43.1
P7  (via drill 0.35)
  Top 0.61: J1.6 16.77,35.97 v17.83,34.9 | R27.1 43.59,2.74 30.02,2.74 28.19,4.57 28.19,6.43 R21.1 28.88,7.32 v19.81,7.32 19.81,5.33 17.98,3.51 9.45,3.51 8.69,4.27 8.69,6.59 R15.1
  Bottom 0.61: v17.83,34.9 20.12,32.61 20.12,25.76 18.59,24.23 18.59,8.53 v19.81,7.32
P8  (via drill 0.35)
  Top 0.61: J1.2 19.17,40.97 20.57,42.37 65.53,42.37 66.75,41.15 66.75,36.27 v65.38,34.9
  Bottom 0.61: v65.38,34.9 57.91,27.43 57.91,12.19 63.55,6.55 R33.1 85.25,6.55 R38.1 86.44,6.55 105.42,6.55 R44.1

### Text on the board
tPlace: MONREAL TRIGO, JAVIER - FPU17/03239 / TERRES HARO, JOSE M. - FPU17/03800 | . | . | . | . | . | . | . | . | . | . | . | . | Rc values: / - Blue 470 nm: 220 / - Amber 590 nm: 91 | . | . | . | . | . | . | RTI2018-100910-B-C43 / MINECO/FEDER | . | . | . | . | . | .